# EAGLE design RoomSenosorV1 (EAGLE 6.5.0)
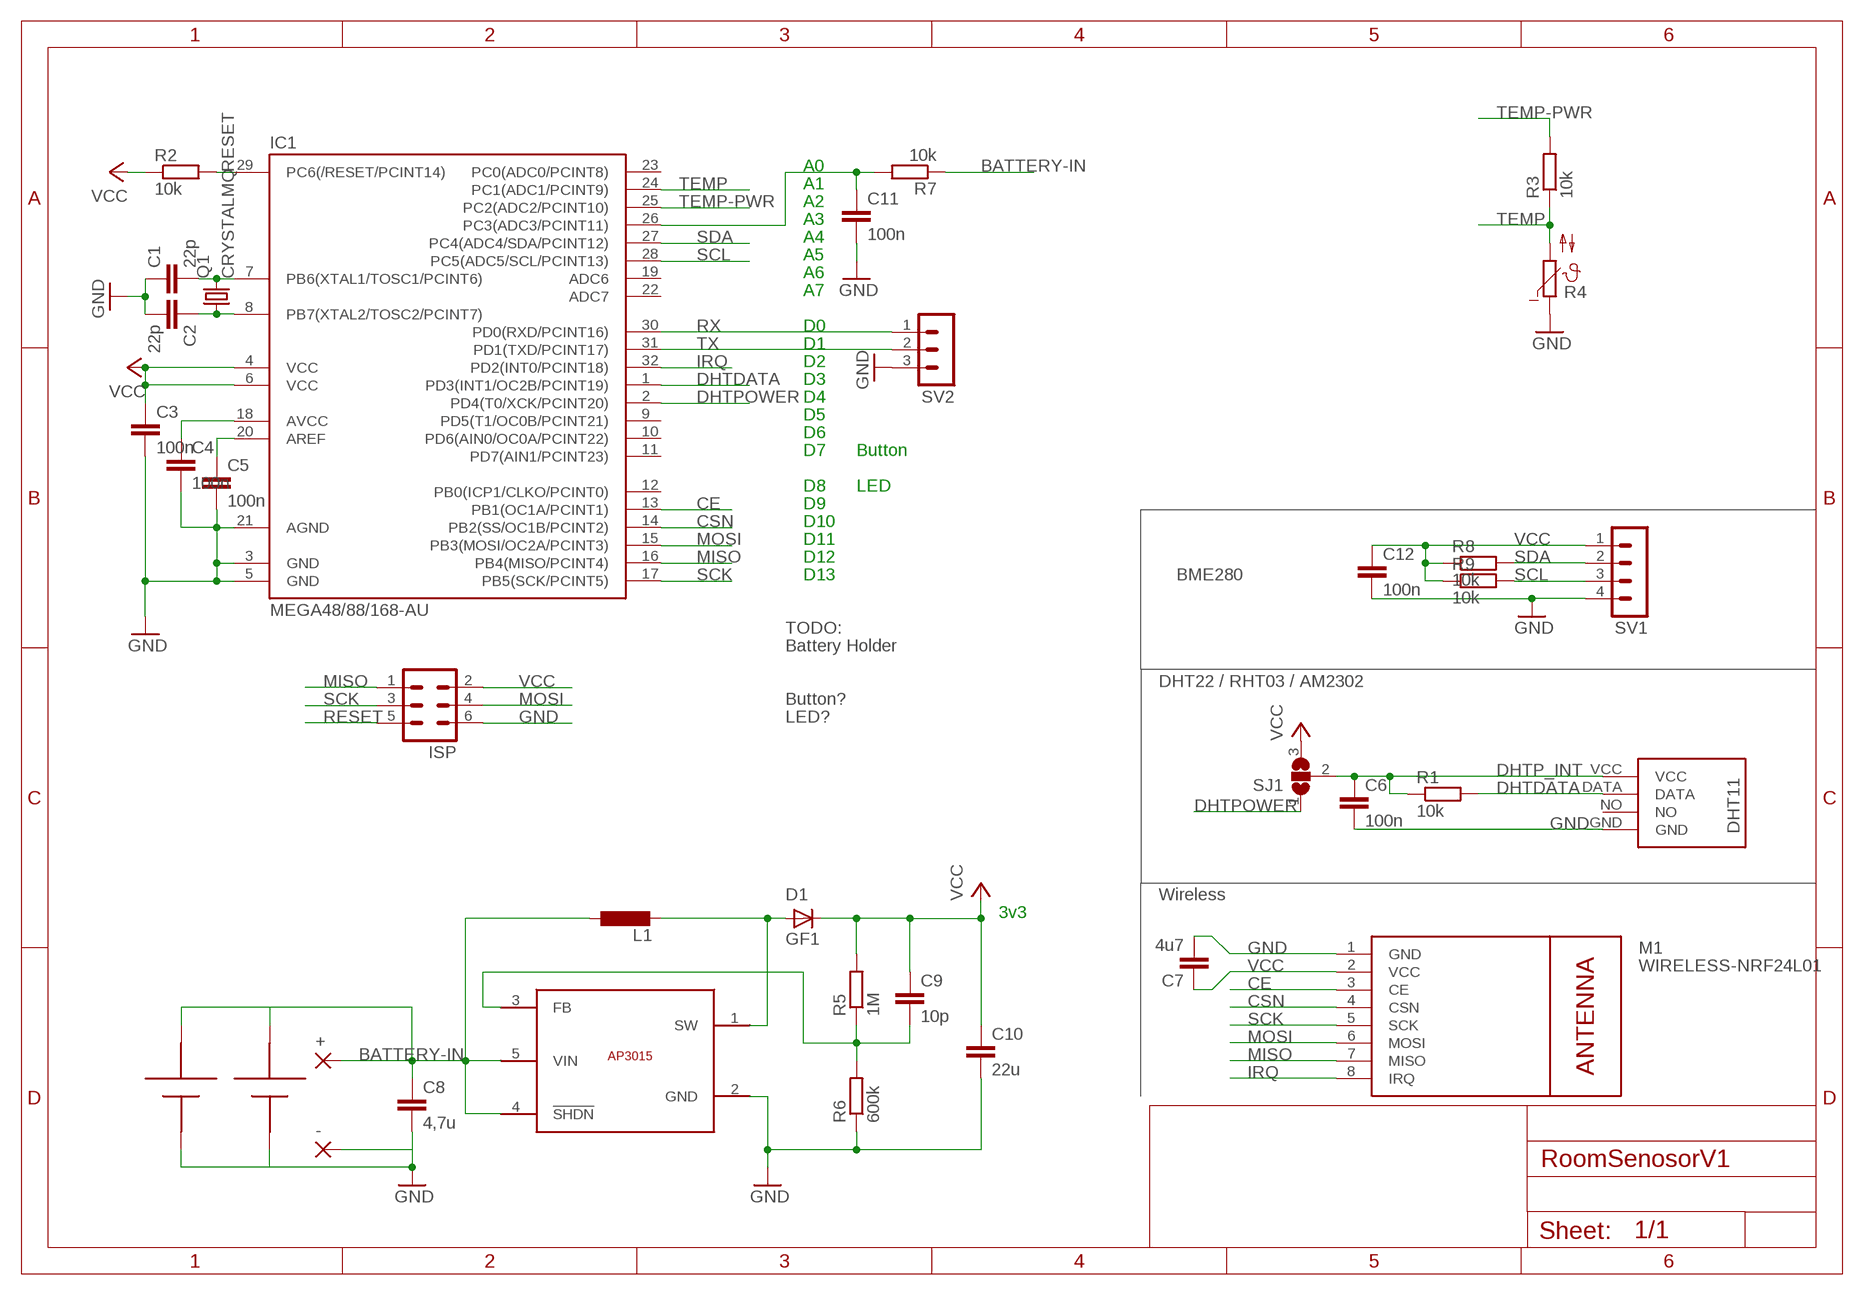
[diagram p0: schematic, sheet 1]

## Parts
+  1,6/0,8  [1,6/0,8]
-  1,6/0,8  [1,6/0,8]
C1  22p  C-EUC0805  [C0805]
C2  22p  C-EUC0805  [C0805]
C3  100n  C-EUC0805  [C0805]
C4  100n  C-EUC0805  [C0805]
C5  100n  C-EUC0805  [C0805]
C6  100n  C-EUC0805  [C0805]
C7  4u7  C-EUC0805  [C0805]
C8  4,7u  C-EUC0805  [C0805]
C9  10p  C-EUC0805  [C0805]
C10  22u  C-EUC1206  [C1206]
C11  100n  C-EUC0805  [C0805]
C12  100n  C-EUC0805  [C0805]
D1  GF1  [SMA-DO214AC]
IC1  MEGA48/88/168-AU  [TQFP32-08]
ISP  MA03-2  [MA03-2]
L1  L-EUL2825P  [L2825P]
M1  WIRELESS-NRF24L01  [WIRELESS-NRF24L01]
Q1  CRYSTALMQ  [MQ]
R1  10k  R-EU_R0805  [R0805]
R2  10k  R-EU_R0805  [R0805]
R3  10k  R-EU_R0805  [R0805]
R4  NTC640  [P640]
R5  1M  R-EU_R0805  [R0805]
R6  600k  R-EU_R0805  [R0805]
R7  10k  R-EU_R0805  [R0805]
R8  10k  R-EU_R0805  [R0805]
R9  10k  R-EU_R0805  [R0805]
SJ1  SJ2W  [SJ_2]
SV1  MA04-1  [MA04-1]
SV2  MA03-1  [MA03-1]
U$1  AP3015/A  [SOT353]
U$2  DHT11  [DHT11]
U$3  MIGNON_1  [MIGNON_1]
U$4  RS_279-4959  [RS_279-4959]

## Nets
BATTERY-IN: +.1(P) C8.1 L1.1 R7.1 U$1.4(!SHDN) U$1.5(VIN) U$3.POS U$4.POS
BATTERY-IN-LP: C11.1 IC1.26(PC3(ADC3/PCINT11)) R7.2
CE: IC1.13(PB1(OC1A/PCINT1)) M1.3(CE)
CSN: IC1.14(PB2(SS/OC1B/PCINT2)) M1.4(CSN)
DHTDATA: IC1.1(PD3(INT1/OC2B/PCINT19)) R1.2 U$2.DATA
DHTP_INT: C6.1 R1.1 SJ1.2 U$2.VCC
DHTPOWER: IC1.2(PD4(T0/XCK/PCINT20)) SJ1.1
GND: -.1(P) C1.1 C2.2 C3.2 C4.2 C5.2 C6.2 C7.2 C8.2 C10.2 C11.2 C12.2 IC1.3(GND) IC1.5(GND) IC1.21(AGND) ISP.6 M1.1(GND) R4.1 R6.1 SV1.4 SV2.3 U$1.2(GND) U$2.GND U$3.NEG U$4.NEG
IRQ: IC1.32(PD2(INT0/PCINT18)) M1.8(IRQ)
MISO: IC1.16(PB4(MISO/PCINT4)) ISP.1 M1.7(MISO)
MOSI: IC1.15(PB3(MOSI/OC2A/PCINT3)) ISP.4 M1.6(MOSI)
N$2: C2.1 IC1.8(PB7(XTAL2/TOSC2/PCINT7)) Q1.P1
N$3: C1.2 IC1.7(PB6(XTAL1/TOSC1/PCINT6)) Q1.P3
N$4: C9.2 R5.1 R6.2 U$1.3(FB)
N$6: C5.1 IC1.20(AREF)
N$8: C4.1 IC1.18(AVCC)
N$10: D1.A L1.2 U$1.1(SW)
RESET: IC1.29(PC6(/RESET/PCINT14)) ISP.5 R2.2
RX: IC1.30(PD0(RXD/PCINT16)) SV2.1
SCK: IC1.17(PB5(SCK/PCINT5)) ISP.3 M1.5(SCK)
SCL: IC1.28(PC5(ADC5/SCL/PCINT13)) R9.2 SV1.3
SDA: IC1.27(PC4(ADC4/SDA/PCINT12)) R8.2 SV1.2
TEMP: IC1.24(PC1(ADC1/PCINT9)) R3.1 R4.2
TEMP-PWR: IC1.25(PC2(ADC2/PCINT10)) R3.2
TX: IC1.31(PD1(TXD/PCINT17)) SV2.2
VCC: C3.1 C7.1 C9.1 C10.1 C12.1 D1.K(C) IC1.4(VCC) IC1.6(VCC) ISP.2 M1.2(VCC) R2.1 R5.2 R8.1 R9.1 SJ1.3 SV1.1
Unconnected: IC1.9(PD5(T1/OC0B/PCINT21)) IC1.10(PD6(AIN0/OC0A/PCINT22)) IC1.11(PD7(AIN1/PCINT23)) IC1.12(PB0(ICP1/CLKO/PCINT0)) IC1.19(ADC6) IC1.22(ADC7) IC1.23(PC0(ADC0/PCINT8)) Q1.P2(GND) Q1.P4(GND1) U$2.NO

## Notes on the sheet
- A0
- A1
- A2
- A3
- A4
- A5
- A6
- A7
- D0
- D1
- D2
- D3
- D4
- D5
- D6
- D7 | Button
- D8 | LED
- D9
- D10
- D11
- D12
- D13 | BME280
- TODO:
- Battery Holder
- DHT22 / RHT03 / AM2302
- Button?
- LED?
- Wireless
- 3v3

## Library data of the parts
+ - = wirepad:1,6/0,8: THROUGH-HOLE PAD
C1-C12 = rcl:C-EU: CAPACITOR, European symbol
D1 = diode:GF1: DIODE
IC1 = avr-6:MEGA48/88/168
ISP = con-lstb:MA03-2: PIN HEADER; OC_FARNELL: unknown; OC_NEWARK: unknown
L1 = rcl:L-EU: INDUCTOR, European symbol
M1 = diy-modules:WIRELESS-NRF24L01: 2.4 GHz Wireless Module based on NRF24L01 chip
Q1 = Crystals-new:CRYSTAL
R1-R3 R5-R9 = rcl:R-EU_: RESISTOR, European symbol
R4 = ptc-ntc:NTC640: PHILIPS NTC; OC_FARNELL: unknown; OC_NEWARK: unknown
SJ1 = jumper:SJ2W: SMD solder JUMPER
SV1 = con-lstb:MA04-1: PIN HEADER; OC_FARNELL: unknown; OC_NEWARK: unknown
SV2 = con-lstb:MA03-1: PIN HEADER; OC_FARNELL: unknown; OC_NEWARK: unknown
U$1 = AP3015:AP3015/A
U$2 = DHT11:DHT11: DHT11 Czujnik temperatury i wilgotności
U$3 = ReicheltBattery:MIGNON_1
U$4 = Battery:RS_279-4959

## Board
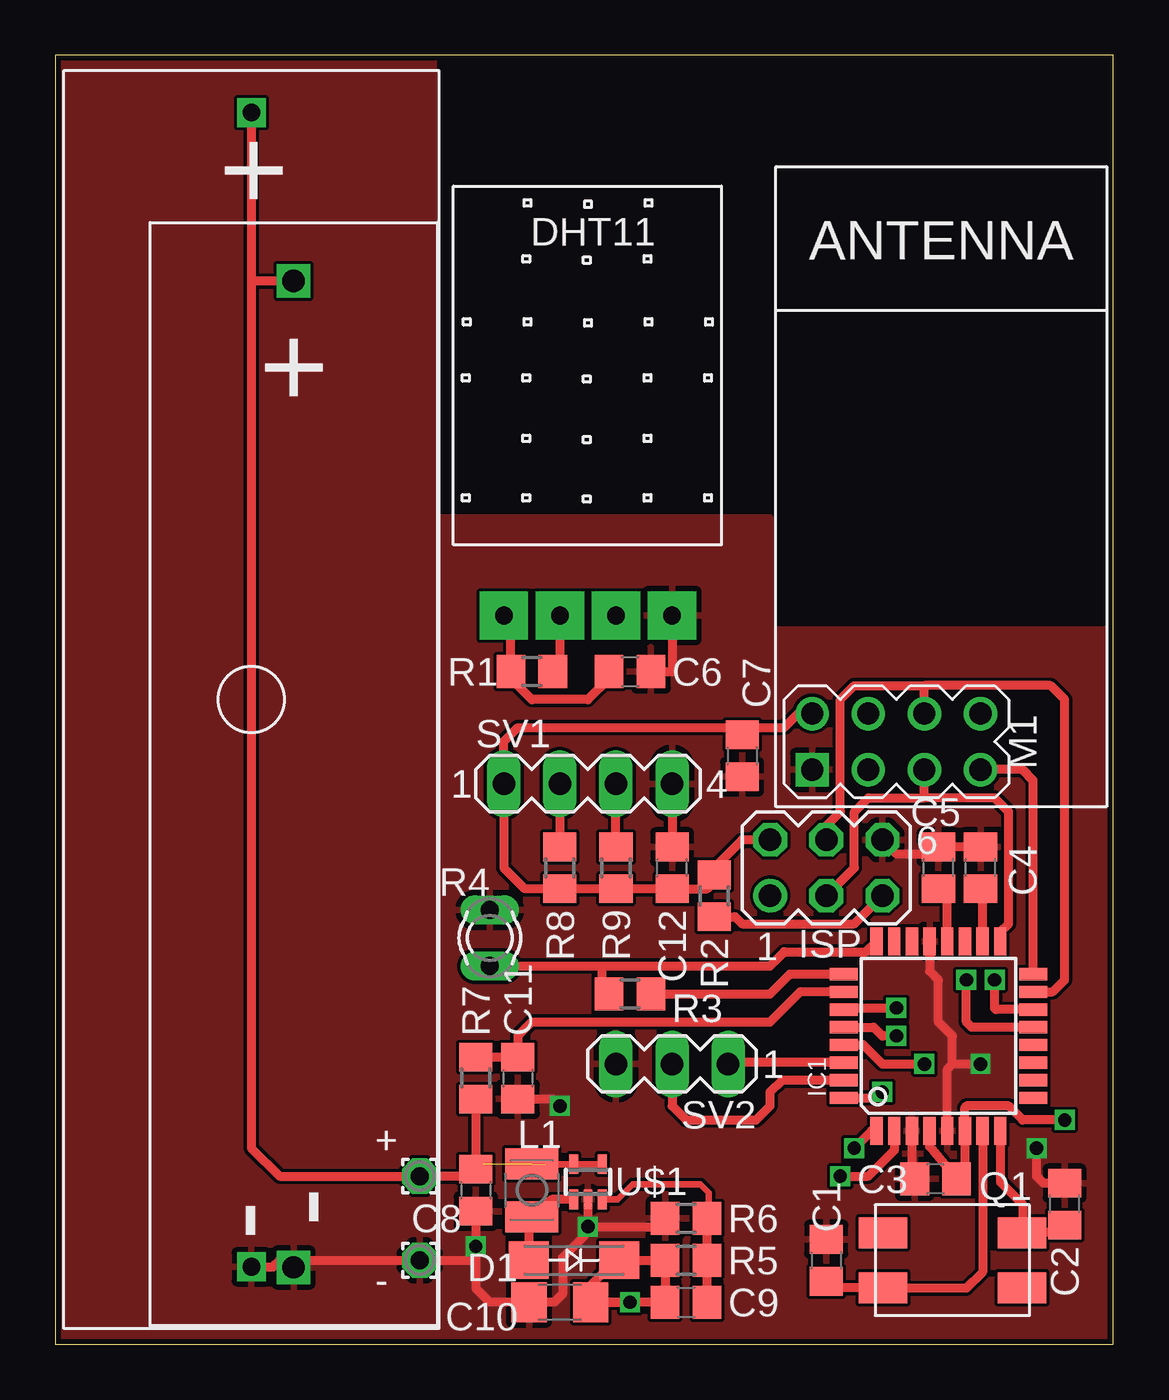
[diagram p1: board, top side]
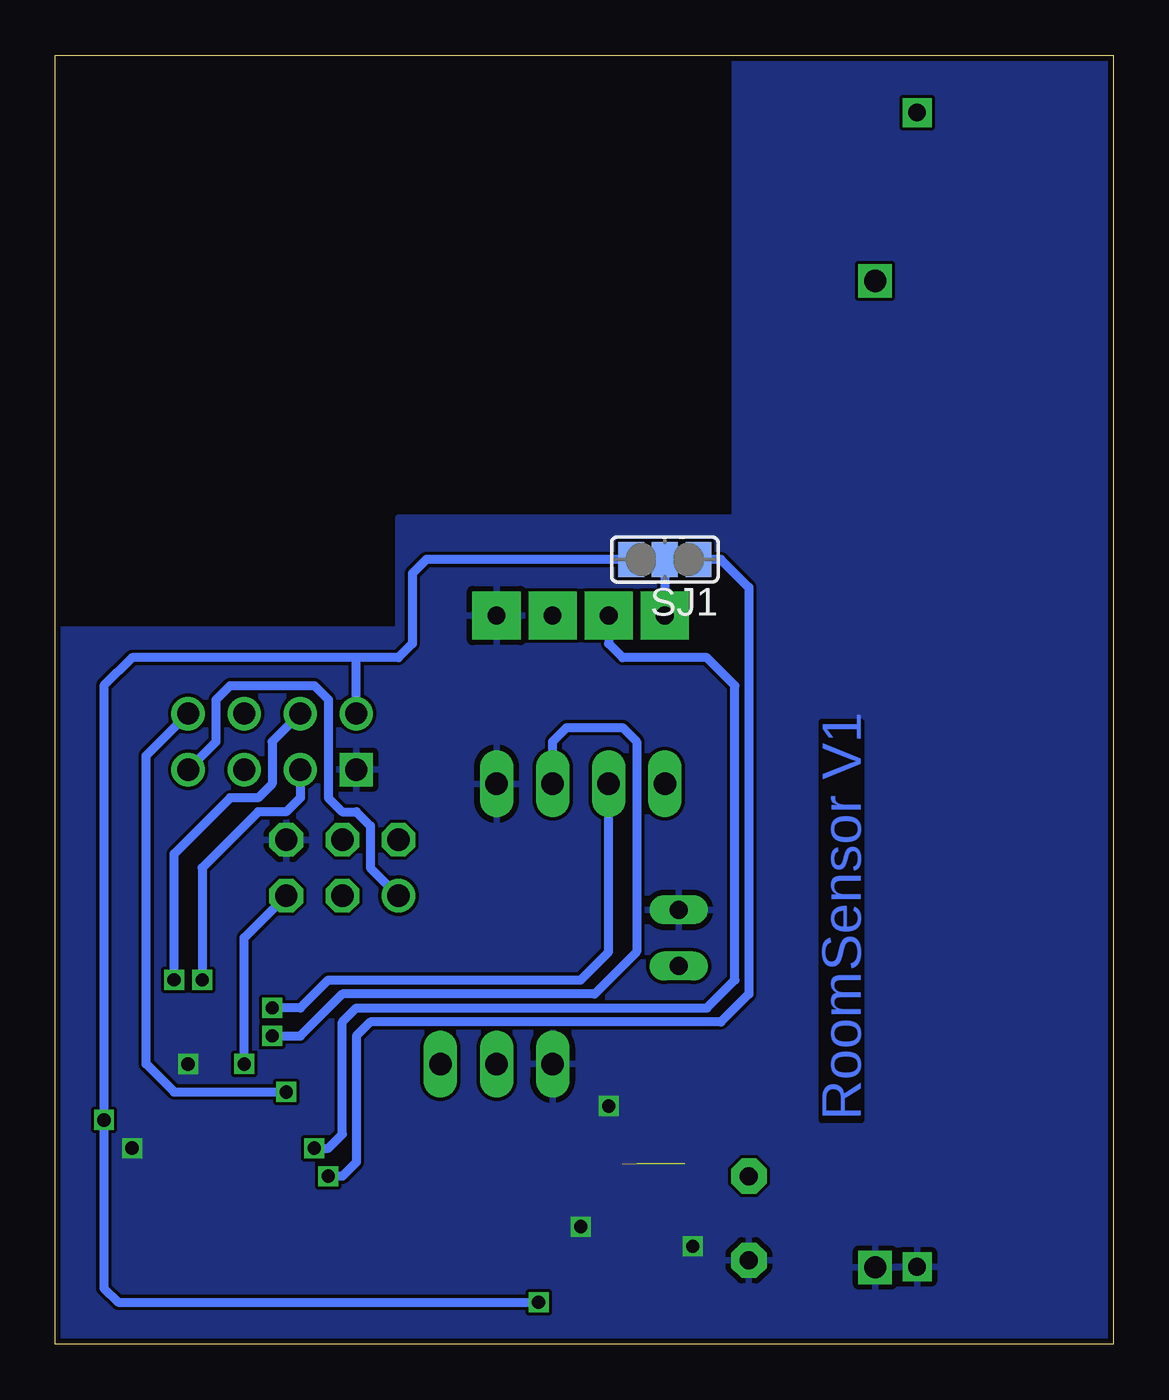
[diagram p2: board, bottom side, seen from below]

Size 47.93 x 58.41 mm. Coordinates in mm from the lower left corner, seen from the top.
Outline: 0,0 47.93,0 47.93,58.41 0,58.41 0,0
Copper layers (1*16): Top 0.035mm / dielectric 1.5mm / Bottom 0.035mm
Design rules "Elecrow_2-layer_eagle_rule": minimum track width 6mil, minimum drill 12mil, track to track 6mil, track to pad 6mil, pad to pad 6mil, via to via 6mil, smd to smd 0mil, copper to edge 10mil, drill to drill 10mil, minimum pad ring 10mil, minimum via ring 6mil, stop-mask expansion 2mil, vias tented up to drill 100mil, thermal gap 10mil

### Footprints (pad centres in the part's own frame; a part is rotated, then mirrored left to right if it is on the bottom)
1,6/0,8 = drill 0.813 pad 1.6 octagon: 1 0,0
C0805 = smd 1.3 x 1.5: 1 -0.95,0; 2 0.95,0
C1206 = smd 1.6 x 1.8: 1 -1.4,0; 2 1.4,0
SMA-DO214AC = smd 1.8 x 1.7: A -2.05,0; K 2.05,0
TQFP32-08 = smd 1.27 x 0.559: 1 -4.293,2.8; 2 -4.293,2; 3 -4.293,1.2; 4 -4.293,0.4; 5 -4.293,-0.4; 6 -4.293,-1.2; 7 -4.293,-2; 8 -4.293,-2.8; 17 4.293,-2.8; 18 4.293,-2; 19 4.293,-1.2; 20 4.293,-0.4; 21 4.293,0.4; 22 4.293,1.2; 23 4.293,2; 24 4.293,2.8 | smd 0.559 x 1.27: 9 -2.8,-4.293; 10 -2,-4.293; 11 -1.2,-4.293; 12 -0.4,-4.293; 13 0.4,-4.293; 14 1.2,-4.293; 15 2,-4.293; 16 2.8,-4.293; 25 2.8,4.293; 26 2,4.293; 27 1.2,4.293; 28 0.4,4.293; 29 -0.4,4.293; 30 -1.2,4.293; 31 -2,4.293; 32 -2.8,4.293
MA03-2 = drill 1.016: 1 -2.54,-1.27 | drill 1.016 octagon: 2 -2.54,1.27; 3 0,-1.27; 4 0,1.27; 5 2.54,-1.27; 6 2.54,1.27
L2825P = smd 1.4 x 2.4: 1 -1.2,0; 2 1.2,0
WIRELESS-NRF24L01 = drill 1 square: 1 -12.7,6.35 | drill 1: 2 -10.16,6.35; 3 -12.7,3.81; 4 -10.16,3.81; 5 -12.7,1.27; 6 -10.16,1.27; 7 -12.7,-1.27; 8 -10.16,-1.27
MQ = smd 2.2 x 1.4: P1 -3.15,-1.25; P2 3.15,-1.25; P3 3.15,1.25; P4 -3.15,1.25
R0805 = smd 1.3 x 1.5: 1 -0.95,0; 2 0.95,0
P640 = drill 0.813 long: 1 -1.27,0; 2 1.27,0
SJ_2 = smd 1.168 x 1.6: 1 -1.524,0; 2 0,0; 3 1.524,0
MA04-1 = drill 1.016 long: 1 -3.81,0; 2 -1.27,0; 3 1.27,0; 4 3.81,0
MA03-1 = drill 1.016 long: 1 -2.54,0; 2 0,0; 3 2.54,0
SOT353 = smd 0.4 x 0.9: 1 -0.65,-0.8; 2 0,-0.8; 3 0.65,-0.8; 4 0.65,0.8; 5 -0.65,0.8
DHT11 = drill 0.8 pad 2.184 square: DATA -1.27,-11.43; GND 3.81,-11.43; NO 1.27,-11.43; VCC -3.81,-11.43
MIGNON_1 = drill 0.8 square: NEG -25.7,0; POS 26.6,0
RS_279-4959 = drill 1 square: NEG 22.35,0; POS -22.35,0

### Placement (x,y rotation side)
+  16.51,7.62 0 top
-  16.51,3.81 0 top
C1  34.92,3.81 270 top
C2  45.72,6.35 90 top
C3  39.88,7.49 180 top
C4  41.91,21.59 90 top
C5  40.01,21.59 90 top
C6  26.04,30.48 0 top
C7  31.11,26.67 270 top
C8  19.05,6.99 270 top
C9  28.57,1.91 0 top
C10  22.86,1.91 180 top
C11  20.95,12.06 270 top
C12  27.94,21.59 90 top
D1  23.5,3.81 0 top
IC1  40.01,13.97 90 top
ISP  34.92,21.59 0 top
L1  21.59,6.99 270 top
M1  40.64,38.73 90 top
Q1  40.64,3.81 180 top
R1  21.59,30.48 0 top
R2  29.84,20.32 270 top
R3  26.04,15.88 0 top
R4  19.68,18.41 270 top
R5  28.57,3.81 180 top
R6  28.57,5.71 0 top
R7  19.05,12.06 90 top
R8  22.86,21.59 90 top
R9  25.4,21.59 90 top
SJ1  20.32,35.56 180 bottom
SV1  24.13,25.4 0 top
SV2  27.94,12.7 180 top
U$1  24.13,7.37 0 top
U$2  24.13,44.45 0 top
U$3  8.89,29.21 90 top
U$4  10.79,25.83 270 top

### Tracks (layer width: path | path; a pad name or v marks a point on that pad's centre or on a via)
BATTERY-IN  (2 unrouted)
  Top 0.305: U$1.4 U$1.5 22.22,8.17 | C8.1 19.41,8.3
  Top 0.406: 19.41,8.19 19.41,8.3 | R7.1 C8.1 19.05,7.62 +.1 10.16,7.62 8.89,8.89 8.89,48.26 | U$3.POS 8.89,48.26 | U$4.POS 8.97,48.18 8.89,48.26
BATTERY-IN-LP
  Top 0.406: R7.2 C11.1 20.95,13.97 21.59,14.61 32.38,14.61 33.75,15.97 IC1.26
CE  (via drill 0.6)
  Top 0.406: IC1.13 41.51,14.37 41.27,14.61 v41.27,16.51
  Bottom 0.406: M1.3 36.83,24.77 37.47,24.13 38.73,24.13 41.27,21.59 v41.27,16.51
CSN  (via drill 0.6)
  Top 0.406: IC1.14 42.62,15.17 42.55,15.24 v42.55,16.51
  Bottom 0.406: v42.55,16.51 42.55,22.23 40.01,24.77 38.73,24.77 38.1,25.4 38.1,27.3 M1.4
DHTDATA  (via drill 0.6)
  Top 0.406: U$2.DATA 22.86,30.8 R1.2 | IC1.1 36.98,9.68 v36.2,8.89
  Bottom 0.406: U$2.DATA 22.86,31.75 22.23,31.11 18.41,31.11 17.14,29.84 17.14,16.51 18.41,15.24 34.29,15.24 34.92,14.61 34.92,9.53 35.56,8.89 v36.2,8.89
DHTP_INT
  Top 0.406: R1.1 20.64,32.7 U$2.VCC | C6.1 25.09,30.16 24.13,29.21 21.59,29.21 20.32,30.48 R1.1 | 20.32,30.16 R1.1
  Bottom 0.406: SJ1.2 U$2.VCC
DHTPOWER  (via drill 0.6)
  Top 0.406: v35.56,7.62 36.83,7.62 38.01,8.79 IC1.2
  Bottom 0.406: v35.56,7.62 34.92,7.62 34.29,8.26 34.29,13.97 33.66,14.61 17.78,14.61 16.51,15.88 16.51,34.29 17.78,35.56 SJ1.1
GND  (via drill 0.6)
  Top 0.406: SV1.4 C12.2 | U$2.GND 27.94,30.48 C6.2 | C4.2 C5.2 39.69,22.23 38.1,22.23 ISP.6 | IC1.21 39.6,16.91 40.01,16.51 40.01,14.61 40.64,13.97 40.64,12.7 | 40.64,12.7 40.41,12.46 IC1.5 | 40.64,12.7 v41.91,12.7 | 19.05,3.81 v19.05,4.45 C8.2 19.05,6.35 | 19.05,3.81 19.05,2.54 19.68,1.91 C10.2 22.61,1.91 22.99,2.29 22.99,3.94 24.13,5.08 v24.13,5.33 | v24.13,5.33 27.24,5.33 R6.1 | U$1.2 v24.13,5.33 | C11.2 22.54,11.12 v22.86,10.79 | U$3.NEG 9.86,3.51 10.16,3.81 -.1 19.05,3.81 | 31.43,26.04 C7.2 | IC1.3 38.8,8.19 39.37,7.62 39.12,7.62 | C2.2 44.77,7.3 44.45,7.62 v44.45,8.89
  pour Bottom: 0,0 48.9,0 48.9,32.38 32.38,32.38 32.38,37.47 17.14,37.47 17.14,58.42 0,58.42
  pour Top: 0,0 49.53,0 50.16,32.38 32.38,32.38 32.38,37.47 17.14,37.47 17.14,58.42 0,58.42
IRQ  (via drill 0.6)
  Top 0.406: IC1.32 37.2,11.17 v37.47,11.43
  Bottom 0.406: M1.8 43.81,26.67 43.81,12.7 42.55,11.43 v37.47,11.43
MISO
  Top 0.406: IC1.16 44.3,25.55 43.81,26.04 M1.7
  Bottom 0.406: M1.7 40.64,27.3 40.64,29.21 40.01,29.84 36.2,29.84 35.56,29.21 35.56,24.77 34.92,24.13 34.29,24.13 33.66,23.5 33.66,21.59 ISP.1
MOSI
  Top 0.406: M1.6 39.37,29.84 | IC1.15 45.18,15.97 45.72,16.51 45.72,29.21 45.09,29.84 39.37,29.84 | ISP.4 34.92,23.5 35.56,24.13 35.56,29.21 36.2,29.84 39.37,29.84
N$2
  Top 0.406: IC1.8 42.8,7.36 43.81,6.35 43.81,5.08 44.41,5.08 | 44.41,5.08 Q1.P1 | C2.1 45.72,5.08 44.41,5.08
N$3
  Top 0.406: C1.2 34.59,2.56 Q1.P3 38.15,2.54 41.27,2.54 42.01,3.27 IC1.7
N$4
  Top 0.305: R6.2 29.59,5.84 29.59,6.86 29.21,7.24 26.16,7.24 25.49,6.57 U$1.3
  Top 0.406: C9.2 R5.1 R6.2
N$6
  Top 0.406: IC1.20 40.41,20.24 arc90 C5.1
N$8
  Top 0.406: IC1.18 42.01,20.55 arc90 C4.1
N$10
  Top 0.406: D1.A 21.45,5.79 L1.2 22.5,6.57 U$1.1
RESET  (via drill 0.6)
  Top 0.406: IC1.29 36.59,13.57 37.47,12.7 v39.37,12.7 | R2.2 30.8,19.37 31.11,19.05 36.2,19.05 ISP.5
  Bottom 0.406: v39.37,12.7 39.37,18.41 ISP.5
RX
  Top 0.406: IC1.30 30.55,12.77 SV2.1
SCK
  Top 0.406: IC1.17 42.8,18.68 43.18,19.05 43.18,24.13 42.55,24.77 39.37,24.77 | 39.37,24.77 M1.5 | ISP.3 36.2,21.59 36.2,24.13 36.83,24.77 39.37,24.77
SCL  (via drill 0.6)
  Top 0.406: R9.2 SV1.3 | v38.1,13.97 37.47,13.97 37.06,14.37 IC1.28
  Bottom 0.406: v38.1,13.97 36.83,13.97 34.92,15.88 23.5,15.88 21.59,17.78 21.59,27.3 22.23,27.94 24.77,27.94 25.4,27.3 SV1.3
SDA  (via drill 0.6)
  Top 0.406: SV1.2 R8.2 | IC1.27 35.78,15.24 v38.1,15.24
  Bottom 0.406: SV1.2 22.86,17.78 24.13,16.51 35.56,16.51 36.83,15.24 v38.1,15.24
TEMP
  Top 0.406: R4.2 24.77,17.14 | 24.77,17.14 32.38,17.14 33.02,17.78 36.72,17.78 IC1.24 | 24.77,17.14 24.77,16.2 R3.1
TEMP-PWR
  Top 0.406: R3.2 32.38,15.88 33.28,16.77 IC1.25
TX
  Top 0.406: SV2.2 27.94,10.79 28.57,10.16 31.75,10.16 32.38,10.79 32.38,11.43 32.92,11.97 IC1.31
VCC  (via drill 0.6)
  Top 0.305: C9.1 v26.04,1.91
  Top 0.406: 25.53,3.81 D1.K R5.2 C9.1 C10.1 | C10.1 v26.04,1.91 | C10.1 | C10.1 24.26,2.67 25.4,3.81 | 31.11,27.94 20.95,27.94 20.32,27.3 SV1.1 20.32,21.59 21.27,20.64 R8.1 R9.1 C12.1 29.53,20.64 29.84,20.95 R2.1 29.84,21.59 31.11,22.86 ISP.2 | 31.11,27.94 33.02,27.94 33.66,28.57 M1.2 | C7.1 31.11,27.94 | 40.64,7.62 C3.1 | IC1.4 39.6,8.97 C3.1 | C3.1 41.2,7.87 IC1.6 41.2,10.72 41.27,10.79 43.18,10.79 43.81,10.16 v45.72,10.16
  Bottom 0.406: M1.2 34.29,31.11 | 34.29,31.11 44.45,31.11 45.72,29.84 v45.72,10.16 45.72,2.54 45.09,1.91 v26.04,1.91 | 34.29,31.11 32.38,31.11 31.75,31.75 31.75,34.92 31.11,35.56 SJ1.3

### Text on the board
Bottom: RoomSensor V1